# EAGLE design CCM_0022 (EAGLE 9.4.2)

## Sheet 1 of 2: cryocooler
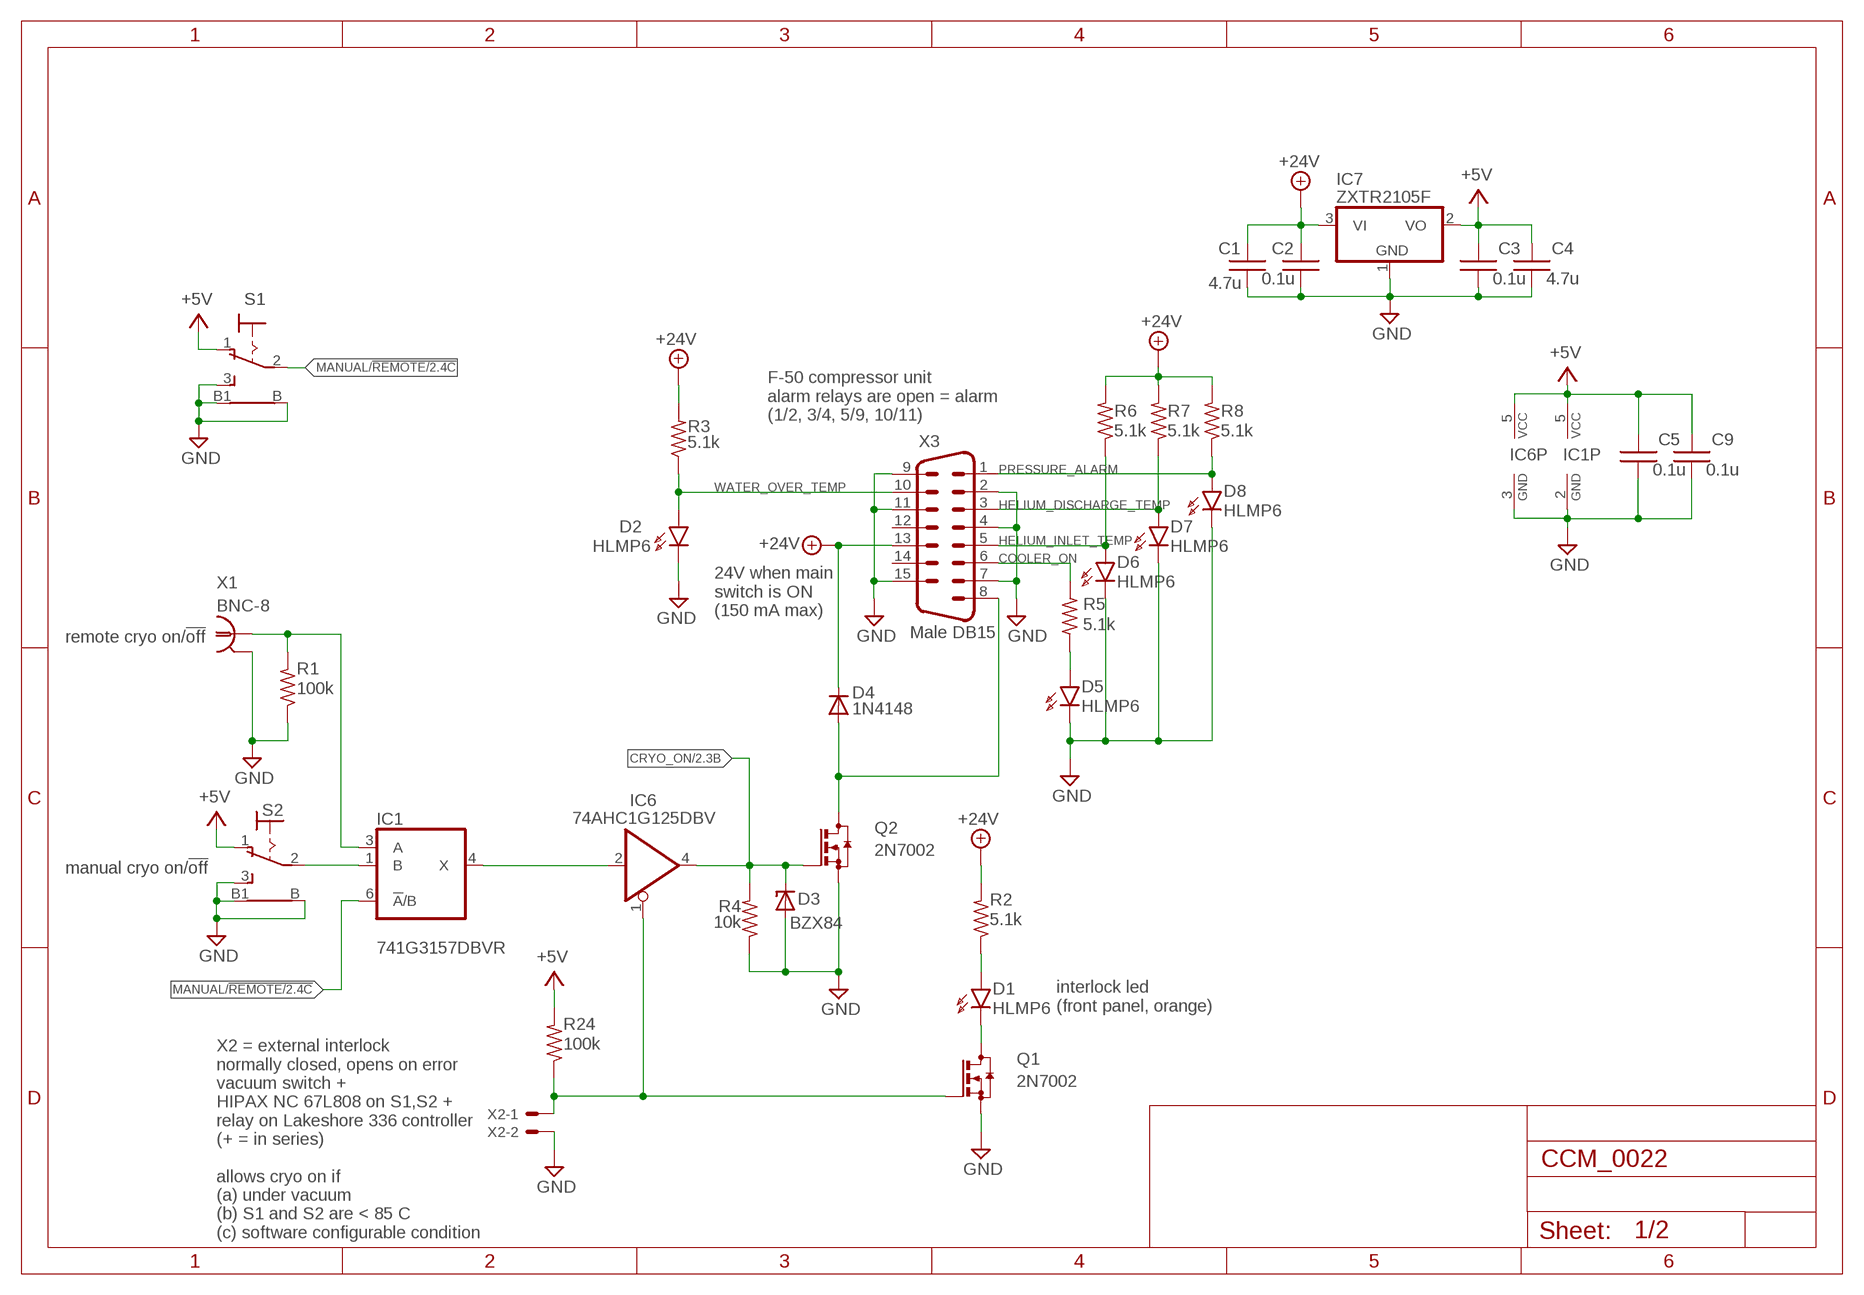
[diagram p0: schematic, sheet 1]

### Parts
C1  4.7u  CAPACITOR0603  [0603]
C2  0.1u  CAPACITOR0603  [0603]
C3  0.1u  CAPACITOR0603  [0603]
C4  4.7u  CAPACITOR0603  [0603]
C5  0.1u  CAPACITOR0603  [0603]
C9  0.1u  CAPACITOR0603  [0603]
D1  HLMP6  [HLMP6]
D2  HLMP6  [HLMP6]
D3  BZX84  BZX84CSMD  [TO236]
D4  1N4148  DIODE-SOD323-W  [SOD323-W]
D5  HLMP6  [HLMP6]
D6  HLMP6  [HLMP6]
D7  HLMP6  [HLMP6]
D8  HLMP6  [HLMP6]
IC1  741G3157DBVR  [DBV_R-PDSO-G6]
IC6  74AHC1G125DBV  [SOT23-5]
IC7  ZXTR2105F  MCP1703CB  [SOT23]
Q1  2N7002  BSS123  [SOT23]
Q2  2N7002  BSS123  [SOT23]
R1  100k  R0603  [0603]
R2  5.1k  R0603  [0603]
R3  5.1k  R0603  [0603]
R4  10k  R0603  [0603]
R5  5.1k  R0603  [0603]
R6  5.1k  R0603  [0603]
R7  5.1k  R0603  [0603]
R8  5.1k  R0603  [0603]
R24  100k  R0603  [0603]
S1  LPV-1  [LPV-1]
S2  LPV-1  [LPV-1]
X1  BNC-8  [BNC_RA]
X2  22-23-2021  [22-23-2021]
X3  Male DB15  M15HP  [M15HP]

### Nets
+5V: C3.1 C4.1 C5.1 C9.1 IC1.5(VCC) IC6.5(VCC) IC7.2(VO) R24.2 S1.1(O) S2.1(O) ; also sheet 2
+24V: C1.1 C2.1 D4.C IC7.3(VI) R2.2 R3.2 R6.2 R7.2 R8.2 X3.13
COOLER_ON: R5.2 X3.6
CRYO_ON: D3.C IC6.4(O) Q2.1(G) R4.2 ; also sheet 2
GND: C1.2 C2.2 C3.2 C4.2 C5.2 C9.2 D2.K D3.A D5.K D6.K D7.K D8.K IC1.2(GND) IC6.3(GND) IC7.1(GND) Q1.2(S) Q2.2(S) R1.1 R4.1 S1.3(S) S1.B S1.B1 S2.3(S) S2.B S2.B1 X1.2 X2.2 X3.2 X3.4 X3.7 X3.9 X3.11 X3.15 ; also sheet 2
HELIUM_DISCHARGE_TEMP: D7.A R7.1 X3.3
HELIUM_INLET_TEMP: D6.A R6.1 X3.5
MANUAL/!REMOTE: IC1.6(!A!/B) S1.2(P) ; also sheet 2
N$1: D1.A R2.1
N$2: IC6.1(OE) Q1.1(G) R24.1 X2.1
N$4: D1.K Q1.3(D)
N$9: IC1.4(X) IC6.2(I)
N$14: D5.A R5.1
N$19: D4.A Q2.3(D) X3.8
N$35: IC1.3(A) R1.2 X1.1
N$40: IC1.1(B) S2.2(P)
PRESSURE_ALARM: D8.A R8.1 X3.1
WATER_OVER_TEMP: D2.A R3.1 X3.10
Unconnected: X3.12 X3.14

### Notes on the sheet
- F-50 compressor unit
  alarm relays are open = alarm
  (1/2, 3/4, 5/9, 10/11)
- 24V when main 
  switch is ON
  (150 mA max)
- remote cryo on/!off
- manual cryo on/!off
- interlock led
  (front panel, orange)
- X2 = external interlock
  normally closed, opens on error
  vacuum switch +
  HIPAX NC 67L808 on S1,S2 +
  relay on Lakeshore 336 controller
  (+ = in series)
  
  allows cryo on if 
  (a) under vacuum
  (b) S1 and S2 are < 85 C
  (c) software configurable condition

## Sheet 2 of 2: heater(s)
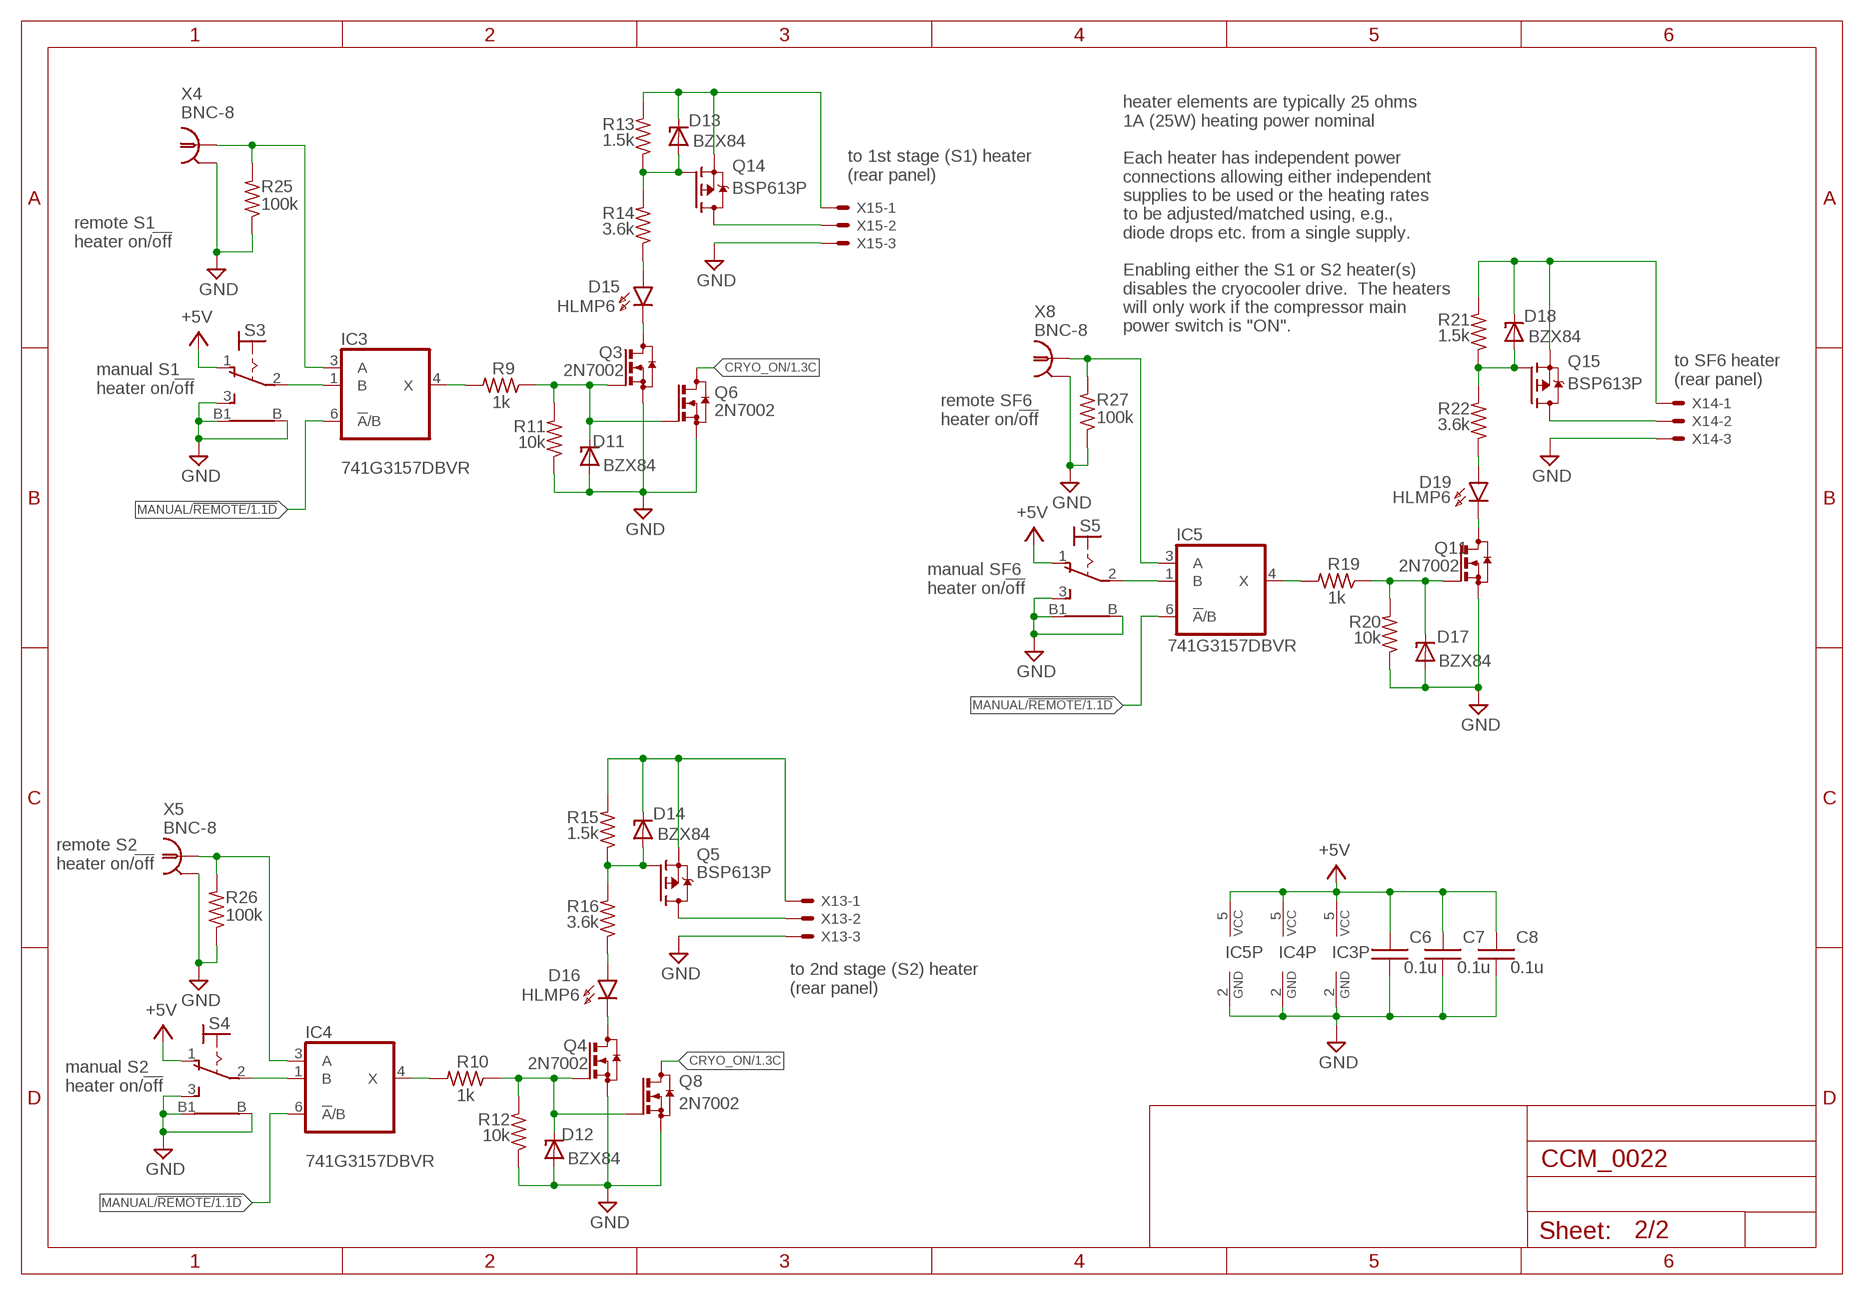
[diagram p1: schematic, sheet 2]

### Parts
C6  0.1u  CAPACITOR0603  [0603]
C7  0.1u  CAPACITOR0603  [0603]
C8  0.1u  CAPACITOR0603  [0603]
D11  BZX84  BZX84CSMD  [TO236]
D12  BZX84  BZX84CSMD  [TO236]
D13  BZX84  BZX84CSMD  [TO236]
D14  BZX84  BZX84CSMD  [TO236]
D15  HLMP6  [HLMP6]
D16  HLMP6  [HLMP6]
D17  BZX84  BZX84CSMD  [TO236]
D18  BZX84  BZX84CSMD  [TO236]
D19  HLMP6  [HLMP6]
IC3  741G3157DBVR  [DBV_R-PDSO-G6]
IC4  741G3157DBVR  [DBV_R-PDSO-G6]
IC5  741G3157DBVR  [DBV_R-PDSO-G6]
Q3  2N7002  BSS123  [SOT23]
Q4  2N7002  BSS123  [SOT23]
Q5  BSP613P  BSP170P  [SOT223]
Q6  2N7002  BSS123  [SOT23]
Q8  2N7002  BSS123  [SOT23]
Q11  2N7002  BSS123  [SOT23]
Q14  BSP613P  BSP170P  [SOT223]
Q15  BSP613P  BSP170P  [SOT223]
R9  1k  R0603  [0603]
R10  1k  R0603  [0603]
R11  10k  R0603  [0603]
R12  10k  R0603  [0603]
R13  1.5k  R0603  [0603]
R14  3.6k  R0603  [0603]
R15  1.5k  R0603  [0603]
R16  3.6k  R0603  [0603]
R19  1k  R0603  [0603]
R20  10k  R0603  [0603]
R21  1.5k  R0603  [0603]
R22  3.6k  R0603  [0603]
R25  100k  R0603  [0603]
R26  100k  R0603  [0603]
R27  100k  R0603  [0603]
S3  LPV-1  [LPV-1]
S4  LPV-1  [LPV-1]
S5  LPV-1  [LPV-1]
X4  BNC-8  [BNC_RA]
X5  BNC-8  [BNC_RA]
X8  BNC-8  [BNC_RA]
X13  22-23-2031  [22-23-2031]
X14  22-23-2031  [22-23-2031]
X15  22-23-2031  [22-23-2031]

### Nets
+5V: C6.1 C7.1 C8.1 IC3.5(VCC) IC4.5(VCC) IC5.5(VCC) S3.1(O) S4.1(O) S5.1(O) ; also sheet 1
CRYO_ON: Q6.3(D) Q8.3(D) ; also sheet 1
GND: C6.2 C7.2 C8.2 D11.A D12.A D17.A IC3.2(GND) IC4.2(GND) IC5.2(GND) Q3.2(S) Q4.2(S) Q6.2(S) Q8.2(S) Q11.2(S) R11.1 R12.1 R20.1 R25.1 R26.1 R27.1 S3.3(S) S3.B S3.B1 S4.3(S) S4.B S4.B1 S5.3(S) S5.B S5.B1 X4.2 X5.2 X8.2 X13.3 X14.3 X15.3 ; also sheet 1
MANUAL/!REMOTE: IC3.6(!A!/B) IC4.6(!A!/B) IC5.6(!A!/B) ; also sheet 1
N$3: D13.C Q14.3(S) R13.2 X15.1
N$5: D14.C Q5.3(S) R15.2 X13.1
N$6: D16.A R16.1
N$7: D16.K Q4.3(D)
N$8: D19.K Q11.3(D)
N$10: D19.A R22.1
N$11: D15.K Q3.3(D)
N$12: D15.A R14.1
N$16: D11.C Q3.1(G) Q6.1(G) R9.1 R11.2
N$17: D13.A Q14.1(G) R13.1 R14.2
N$21: Q14.2(D) Q14.4(D) X15.2
N$23: D12.C Q4.1(G) Q8.1(G) R10.1 R12.2
N$24: D14.A Q5.1(G) R15.1 R16.2
N$26: Q5.2(D) Q5.4(D) X13.2
N$29: IC4.3(A) R26.2 X5.1
N$30: IC4.1(B) S4.2(P)
N$31: D17.C Q11.1(G) R19.1 R20.2
N$32: D18.A Q15.1(G) R21.1 R22.2
N$34: Q15.2(D) Q15.4(D) X14.2
N$39: IC3.3(A) R25.2 X4.1
N$42: IC3.1(B) S3.2(P)
N$45: IC5.3(A) R27.2 X8.1
N$46: IC5.1(B) S5.2(P)
S1_HEATER_ON/!OFF: IC3.4(X) R9.2
S1_HEATER_ON/!OFF1: IC4.4(X) R10.2
S1_HEATER_ON/!OFF2: IC5.4(X) R19.2
SF6_HEATER_VOLTAGE: D18.C Q15.3(S) R21.2 X14.1

### Notes on the sheet
- to 1st stage (S1) heater
  (rear panel)
- remote S1 
  heater on/!off
- heater elements are typically 25 ohms
  1A (25W) heating power nominal
  
  Each heater has independent power 
  connections allowing either independent
  supplies to be used or the heating rates
  to be adjusted/matched using, e.g., 
  diode drops etc. from a single supply.
  
  Enabling either the S1 or S2 heater(s) 
  disables the cryocooler drive.  The heaters
  will only work if the compressor main
  power switch is "ON".
- to SF6 heater
  (rear panel)
- manual S1 
  heater on/!off
- remote SF6 
  heater on/!off
- manual SF6
  heater on/!off
- remote S2 
  heater on/!off
- to 2nd stage (S2) heater
  (rear panel)
- manual S2 
  heater on/!off

## Library data of the parts
C1-C9 = noah:CAPACITOR
D1 D2 D5-D8 D15 D16 D19 = display-hp:HLMP6: LED 2mm horizontal; MF: AGILENT TECHNOLOGIES; MPN: HLMP-6500; OC_FARNELL: 1652490; OC_NEWARK: 40K0088
D3 D11-D14 D17 D18 = diode:BZX84CSMD: Z DIODE
D4 = diode:DIODE-: DIODE
IC1 IC3-IC5 = 74xx-little-de:74*1G3157: Single-Pole, Double-Throw Analog Switch Source: http://focus.ti.com/lit/ds/symlink/sn74lvc1g3157.pdf
IC6 = 74xx-little-de:74*1G125: Single Bus Buffer Gate with 3-State Output
IC7 = linear:MCP1703: 250 mA, 16V, Low Quiescent Current LDO Regulator Source: http://ww1.microchip.com/downloads/en/DeviceDoc/22049b.pdf
Q1-Q4 Q6 Q8 Q11 = transistor-small-signal:BSS123: N-CHANNEL MOS FET
Q5 Q14 Q15 = transistor-fet:BSP170P: SIPMOS(R) Small-Signal-Transistor P-Channel, Enhancement mode Source: http://www.infineon.com/upload/Document/BSP170P_Rev2.4.pdf
R1-R16 R19-R22 R24-R27 = acrooptics:R: 0603 resistor
S1-S5 = switch:LPV-1: TOGGLE SWITCH
X1 X4 X5 X8 = noah:BNC: JACK, RIGHT ANGLE, 50 OHM, PCB, BNC Source: amp_227161.pdf; OC_FARNELL: unknown; OC_NEWARK: unknown
X2 = con-molex:22-23-2021: .100" (2.54mm) Center Header - 2 Pin; MF: MOLEX; MPN: 22-23-2021; OC_FARNELL: 1462926; OC_NEWARK: 25C3832
X3 = con-subd:M15: SUB-D; OC_FARNELL: unknown; OC_NEWARK: unknown
X13-X15 = con-molex:22-23-2031: .100" (2.54mm) Center Header - 3 Pin; MF: MOLEX; MPN: 22-23-2031; OC_FARNELL: 1462950; OC_NEWARK: 30C0862

## Net classes
1 standard: width 0.61 mm, clearance 0.254 mm

## Board
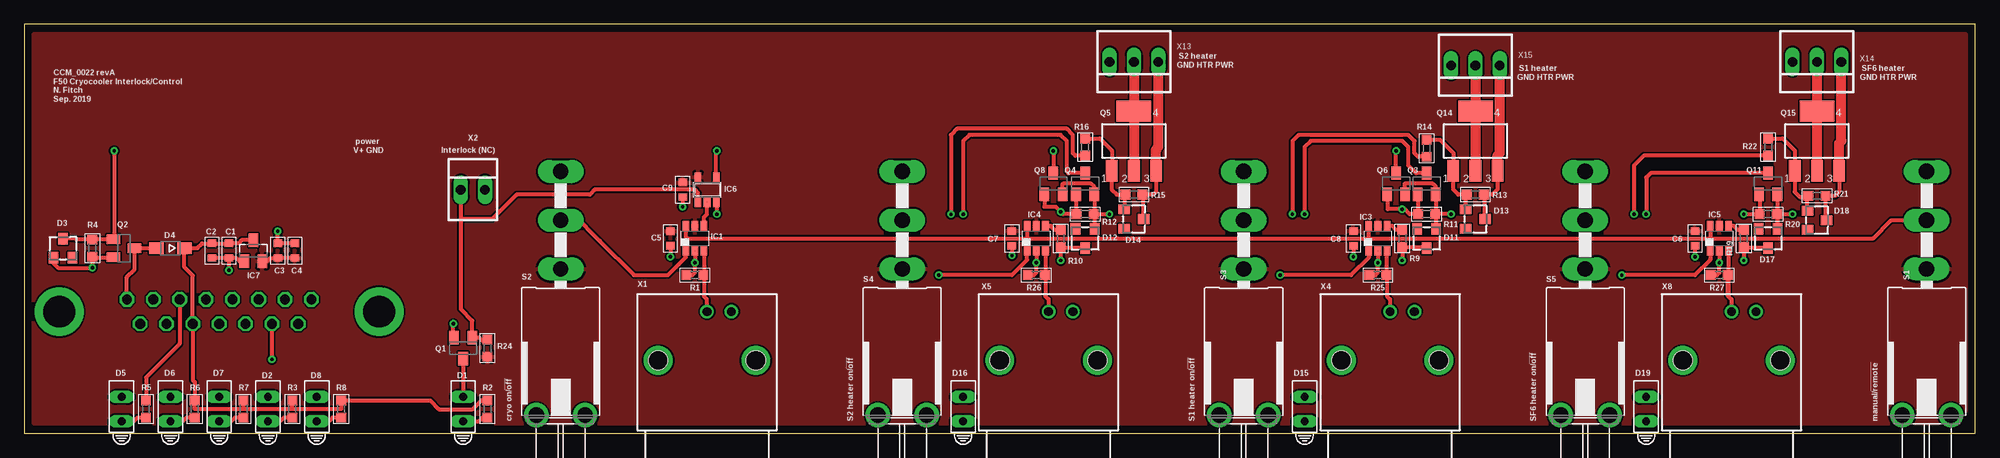
[diagram p2: board, top side]
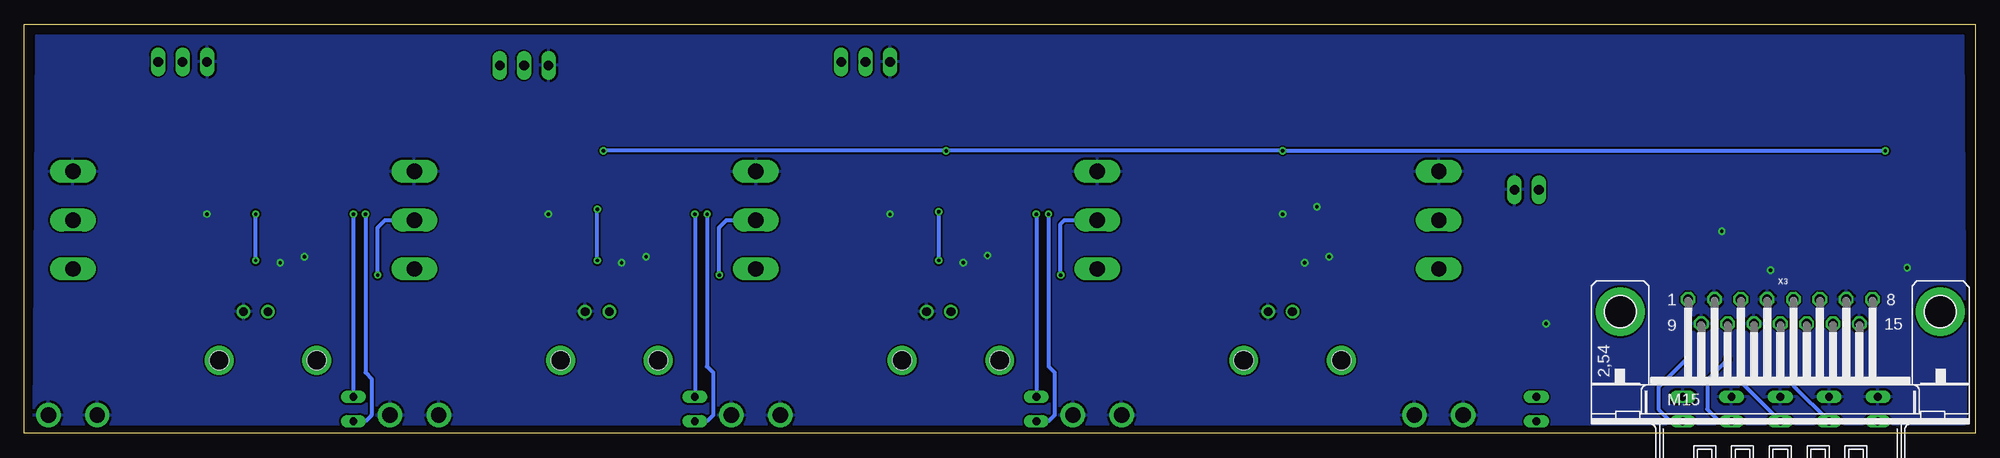
[diagram p3: board, bottom side, seen from below]

Size 203.2 x 42.67 mm. Coordinates in mm from the lower left corner, seen from the top.
Outline: 0,0 203.2,0 203.2,42.67 0,42.67 0,0
Copper layers (1*16): Top 0.035mm / dielectric 1.5mm / Bottom 0.035mm
Design rules "default *": minimum track width 10mil, minimum drill 10mil, track to track 7mil, track to pad 7mil, pad to pad 7mil, via to via 7mil, smd to smd 7mil, copper to edge 10mil, drill to drill 8mil, minimum pad ring 10mil, minimum via ring 8mil, stop-mask expansion 4mil, vias tented up to drill 0mil, thermal gap 10mil

### Footprints (pad centres in the part's own frame; a part is rotated, then mirrored left to right if it is on the bottom)
0603 = smd 0.762 x 0.889: 1 -0.762,0; 2 0.762,0
HLMP6 = drill 0.813 long: A -1.27,0; K 1.27,0
TO236 = smd 1 x 1.2: A -1,-1; C 0,1; NC 1,-1
SOD323-W = smd 1.5 x 1.2: A 1.45,0; C -1.45,0
DBV_R-PDSO-G6 = smd 0.69 x 0.99: 1 -0.95,-1.29; 2 0,-1.29; 3 0.95,-1.29; 4 0.95,1.3; 5 0,1.3; 6 -0.95,1.3
SOT23-5 = smd 0.69 x 0.99: 1 -0.95,-1.29; 2 0,-1.29; 3 0.95,-1.29; 4 0.95,1.3; 5 -0.95,1.3
SOT23 = smd 1 x 1.4: 1 -0.95,-1.1; 2 0.95,-1.1; 3 0,1.1
SOT223 = smd 1.219 x 2.235: 1 -2.311,-3.099; 2 0,-3.099; 3 2.311,-3.099 | smd 3.6 x 2.2: 4 0,3.099
0603' = smd 1.016 x 1.016: 1 -0.889,0; 2 0.889,0
LPV-1 = drill 1.6 long: 1 0,15.24; 2 0,20.32; 3 0,25.4 | drill 1.6 pad 2.54: B -2.54,0; B1 2.54,0
BNC_RA = drill 0.9 pad 1.27: 1 0,-5.08; 2 -2.54,-5.08 | drill 2: P$1 -5.08,0; P$2 5.08,0 | hole 2: -5.08,0; 5.08,0
22-23-2021 = drill 1 long: 1 -1.27,0; 2 1.27,0
M15HP = drill 1.016 octagon: 1 -9.601,1.27; 2 -6.858,1.27; 3 -4.115,1.27; 4 -1.372,1.27; 5 1.372,1.27; 6 4.115,1.27; 7 6.858,1.27; 8 9.601,1.27; 9 -8.23,-1.27; 10 -5.486,-1.27; 11 -2.743,-1.27; 12 0,-1.27; 13 2.743,-1.27; 14 5.486,-1.27; 15 8.23,-1.27 | drill 3.302 pad 5.08: G1 -16.662,0; G2 16.662,0
22-23-2031 = drill 1 long: 1 -2.54,0; 2 0,0; 3 2.54,0

### Placement (x,y rotation side)
C1  21.34,19.05 270 top
C2  19.56,19.05 270 top
C3  26.42,19.05 90 top
C4  28.19,19.05 90 top
C5  67.31,20.32 270 top
C6  173.99,20.32 270 top
C7  102.87,20.32 270 top
C8  138.43,20.32 270 top
C9  68.58,25.4 270 top
D1  45.72,2.54 90 top
D2  25.4,2.54 90 top
D3  4.06,19.3 0 top
D4  15.24,19.3 180 top
D5  10.16,2.54 90 top
D6  15.24,2.54 90 top
D7  20.32,2.54 90 top
D8  30.48,2.54 90 top
D11  146.05,20.32 180 top
D12  110.49,20.32 180 top
D13  151.13,22.35 270 top
D14  115.57,22.35 270 top
D15  133.35,2.54 90 top
D16  97.79,2.54 90 top
D17  181.61,20.32 180 top
D18  186.69,22.23 270 top
D19  168.91,2.54 90 top
IC1  69.85,20.32 0 top
IC3  140.97,20.32 0 top
IC4  105.41,20.32 0 top
IC5  176.53,20.32 0 top
IC6  71.12,25.4 0 top
IC7  23.88,19.05 0 top
Q1  45.72,8.89 180 top
Q2  10.41,19.3 270 top
Q3  146.05,26.04 0 top
Q4  110.49,26.04 0 top
Q5  115.57,30.48 0 top
Q6  142.88,26.04 0 top
Q8  107.19,26.04 0 top
Q11  181.61,26.04 0 top
Q14  151.13,30.48 0 top
Q15  186.69,30.48 0 top
R1  100k  [0603']  69.85,16.51 0 top
R2  5.1k  [0603']  48.26,2.54 90 top
R3  5.1k  [0603']  27.94,2.54 90 top
R4  10k  [0603']  7.11,19.3 90 top
R5  5.1k  [0603']  12.7,2.54 90 top
R6  5.1k  [0603']  17.78,2.54 90 top
R7  5.1k  [0603']  22.86,2.54 90 top
R8  5.1k  [0603']  33.02,2.54 90 top
R9  1k  [0603']  143.51,20.32 90 top
R10  1k  [0603']  107.95,20.32 90 top
R11  10k  [0603']  146.05,22.86 180 top
R12  10k  [0603']  110.49,22.86 180 top
R13  1.5k  [0603']  151.13,24.89 0 top
R14  3.6k  [0603']  146.05,29.72 90 top
R15  1.5k  [0603']  115.57,24.89 0 top
R16  3.6k  [0603']  110.49,29.84 90 top
R19  1k  [0603']  179.07,20.32 90 top
R20  10k  [0603']  181.61,22.86 180 top
R21  1.5k  [0603']  186.69,24.77 0 top
R22  3.6k  [0603']  181.61,29.84 90 top
R24  100k  [0603']  48.26,8.89 270 top
R25  100k  [0603']  140.97,16.51 0 top
R26  100k  [0603']  105.41,16.51 0 top
R27  100k  [0603']  176.53,16.51 0 top
S1  198.12,1.91 0 top
S2  55.88,1.91 0 top
S3  127,1.91 0 top
S4  91.44,1.91 0 top
S5  162.56,1.91 0 top
X1  71.12,7.62 180 top
X2  46.74,25.4 0 top
X3  20.32,12.7 0 bottom
X4  142.24,7.62 180 top
X5  106.68,7.62 180 top
X8  177.8,7.62 180 top
X13  115.57,38.73 180 top
X14  186.69,38.73 180 top
X15  151.13,38.35 180 top

### Tracks (layer width: path | path; a pad name or v marks a point on that pad's centre or on a via)
+5V
  Top 0.406: IC7.2 25.32,17.95 25.65,18.29 C3.1 C4.1
  pour Top: 1.02,1.02 1.02,41.66 202.18,41.66 202.18,1.02
+24V
  Top 0.406: 22.86,2.54 17.78,2.54 R6.2 17.78,5.33 17.58,5.54 X3.13 17.58,16.46 16.69,17.35 D4.C 18.03,19.3 18.54,19.81 C2.1 C1.1 22.35,19.81 22.69,20.15 IC7.3 | 22.86,2.54 R7.2 | 27.94,2.54 33.02,2.54 R8.2 42.29,3.43 43.18,2.54 46.74,2.54 47.65,3.45 48.28,3.45 R2.2 | 27.94,2.54 R3.2 | 27.94,2.54 22.86,2.54
COOLER_ON
  Top 0.406: R5.2 12.7,5.84 16.2,9.35 X3.6
CRYO_ON  (via drill 0.35)
  Top 0.406: D3.C 4.08,20.32 5.33,20.32 5.46,20.19 R4.2 9.25,20.19 Q2.1 9.4,20.34 v9.4,29.46 | IC6.4 72.07,29.4 v72.14,29.46 | v107.19,29.46 Q8.3 | Q6.3 142.88,29.34 v142.88,29.46
  Bottom 0.406: v142.88,29.46 v107.19,29.46 v72.14,29.46 v9.4,29.46
GND  (via drill 0.35)
  Top 0.406: IC1.2 v69.85,17.78 69.85,16.76 69.6,16.51 R1.1 | C5.2 v67.31,18.41 | 111.44,22.92 Q4.2 111.44,25.72 111.12,26.04 108.2,26.04 108.14,25.97 Q8.2 | 111.44,22.92 R12.1 v113.03,22.86 | D12.A 111.49,22.87 111.44,22.92 | IC4.2 v105.41,17.78 105.41,16.76 105.16,16.51 R26.1 | IC3.2 v140.97,17.78 140.97,16.76 140.72,16.51 R25.1 | C7.2 v102.87,18.54 | C8.2 v138.43,18.41 | R11.1 147,22.92 Q3.2 147,25.72 146.69,26.04 143.76,26.04 143.76,25 Q6.2 | v148.59,22.86 R11.1 | D11.A 147.05,22.75 R11.1 | IC5.2 v176.53,17.78 176.53,16.76 176.28,16.51 R27.1 | C6.2 v173.99,18.41 | R20.1 v184.15,22.86 | Q11.2 182.56,22.92 R20.1 | D17.A 182.61,22.75 R20.1 | IC6.3 72.14,24.04 v72.14,22.86 | Q1.2 44.7,10.06 v44.7,11.43 | C9.2 v68.58,23.62 | C1.2 C2.2 | IC7.1 22.44,17.95 22.1,18.29 C1.2 | C1.2 v21.34,17.02 | v26.42,21.08 C3.2 C4.2 | Q2.2 7.17,18.35 R4.1 v7.11,17.27 3.56,17.27 3.06,17.76 D3.A
  pour Bottom: 1.02,1.02 1.27,41.4 201.93,41.4 202.18,1.02
HELIUM_DISCHARGE_TEMP
  Top 0.406: D7.A 21.59,1.27 21.97,1.65 R7.1
  Bottom 0.406: X3.3 24.43,5.38 D7.A
HELIUM_INLET_TEMP
  Top 0.406: R6.1 16.89,1.65 16.51,1.27 D6.A
  Bottom 0.406: X3.5 18.95,4.98 D6.A
MANUAL/!REMOTE
  Top 0.406: IC1.6 68.9,20.51 69.09,20.32 104.39,20.32 | IC4.6 104.46,20.39 104.39,20.32 | 104.39,20.32 113.71,20.32 113.81,20.32 115.33,20.32 115.43,20.32 139.95,20.32 140.02,20.32 | 140.02,20.32 IC3.6 | 140.02,20.32 142.62,20.32 175.58,20.32 | IC5.6 175.58,20.32 | 175.58,20.32 192.53,20.32 194.44,22.23 S1.2
N$1
  Top 0.406: R2.1 47.75,1.65 47.37,1.27 D1.A
N$2
  Top 0.406: R24.1 48.13,9.65 47.75,9.65 47.41,9.99 Q1.1 46.67,11.75 45.47,12.95 45.47,22.35 | IC6.1 70.17,25.08 69.85,25.4 59.44,25.4 58.93,24.89 51.31,24.89 48.77,22.35 45.47,22.35 | X2.1 45.47,22.35
N$3
  Top 0.406: Q14.3 153.44,25.43 152.91,24.89 R13.2 152.13,24.78 D13.C
  Top 1.016: Q14.3 153.44,28.98 153.67,29.21 X15.1
N$4
  Top 0.406: Q1.3 D1.K
N$5
  Top 0.406: Q5.3 117.88,25.17 117.6,24.89 R15.2 116.57,24.78 D14.C
  Top 1.016: Q5.3 117.88,29.62 118.11,29.84 X13.1
N$6  (via drill 0.35)
  Top 0.406: R16.1 109.47,28.96 109.22,29.21 109.22,31.11 108.58,31.75 97.16,31.75 96.52,31.11 v96.52,22.86
  Bottom 0.406: v96.52,22.86 96.52,6.99 95.89,6.35 95.89,1.91 96.52,1.27 D16.A
N$7  (via drill 0.35)
  Top 0.406: Q4.3 108.75,27.14 108.58,27.3 108.58,30.48 107.95,31.11 98.42,31.11 97.79,30.48 v97.79,22.86
  Bottom 0.406: v97.79,22.86 D16.K
N$8  (via drill 0.35)
  Top 0.406: Q11.3 169.38,27.14 168.91,26.67 v168.91,22.86
  Bottom 0.406: v168.91,22.86 D19.K
N$9
  Top 0.406: IC1.4 70.8,22.54 71.12,22.86 IC6.2
N$10  (via drill 0.35)
  Top 0.406: R22.1 168.66,28.96 167.64,27.94 v167.64,22.86
  Bottom 0.406: v167.64,22.86 167.64,6.35 167,5.71 167,1.91 167.64,1.27 D19.A
N$11  (via drill 0.35)
  Top 0.406: Q3.3 144.95,27.14 144.15,27.94 144.15,29.84 143.51,30.48 133.99,30.48 133.35,29.84 v133.35,22.86
  Bottom 0.406: v133.35,22.86 D15.K
N$12  (via drill 0.35)
  Top 0.406: R14.1 145.16,28.83 144.78,29.21 144.78,30.48 144.15,31.11 132.72,31.11 132.08,30.48 v132.08,22.86
  Bottom 0.406: v132.08,22.86 132.08,6.99 131.44,6.35 131.44,1.91 132.08,1.27 D15.A
N$14
  Top 0.406: R5.1 11.81,1.65 11.43,1.27 D5.A
N$16  (via drill 0.35)
  Top 0.406: Q3.1 145.16,24.87 R11.2 144.27,22.86 143.76,23.37 v143.51,23.37 141.99,23.37 141.99,24.87 Q6.1 | v143.51,18.03 R9.1 145.94,19.43 D11.C
  Bottom 0.406: v143.51,18.03 v143.51,23.37
N$17
  Top 0.406: D13.A 150.13,24.78 R13.1 149.35,24.89 148.82,25.43 Q14.1 148.84,27.41 148.84,29.21 147.45,30.61 R14.2
N$19
  Top 0.406: D4.A Q2.3 11.51,17.1 10.72,16.31 X3.8
N$21
  Top 1.016: Q14.2 Q14.4 X15.2
N$23  (via drill 0.35)
  Top 0.406: Q4.1 109.54,22.92 R12.2 108.2,22.86 v107.95,23.11 107.44,23.62 106.24,23.62 Q8.1 | D12.C 108.06,19.32 R10.1 v107.95,18.03
  Bottom 0.406: v107.95,18.03 v107.95,23.11
N$24
  Top 0.406: R16.2 112.01,30.73 113.28,29.46 113.28,27.41 Q5.1 113.26,25.43 113.79,24.89 R15.1 114.57,24.78 D14.A
N$26
  Top 1.016: Q5.2 Q5.4 X13.2
N$29
  Top 0.406: IC4.3 106.36,16.51 | 106.36,16.51 106.36,14.29 106.68,13.97 X5.1 | R26.2 106.36,16.51
N$30  (via drill 0.35)
  Top 0.406: IC4.1 104.46,18.1 102.87,16.51 v95.25,16.51
  Bottom 0.406: v95.25,16.51 95.25,21.84 94.87,22.23 S4.2
N$31  (via drill 0.35)
  Top 0.406: Q11.1 180.72,24.87 R20.2 v179.07,22.86 | D17.C 179.18,19.32 R19.1 v179.07,18.03
  Bottom 0.406: v179.07,18.03 v179.07,22.86
N$32
  Top 0.406: D18.A 185.69,24.65 | 185.69,24.65 R21.1 | 185.69,24.65 184.9,24.65 184.38,25.17 Q15.1 184.4,27.41 184.4,29.46 183.13,30.73 R22.2
N$34
  Top 1.016: Q15.2 Q15.4 X14.2
N$35
  Top 0.406: IC1.3 70.8,16.45 | X1.1 71.12,13.97 70.8,14.29 70.8,16.26 70.8,16.45 | R1.2 70.8,16.45
N$39
  Top 0.406: X4.1 142.24,13.97 141.92,14.29 141.92,16.45 R25.2 141.92,16.57 IC3.3
N$40
  Top 0.406: S2.2 57.78,22.23 59.31,20.7 59.94,20.07 63.5,16.51 67.06,16.51 68.9,18.35 IC1.1
N$42  (via drill 0.35)
  Top 0.406: IC3.1 140.02,18.35 138.18,16.51 v130.81,16.51
  Bottom 0.406: v130.81,16.51 130.81,21.46 130.05,22.23 S3.2
N$45
  Top 0.406: IC5.3 177.48,14.29 | 177.48,14.29 177.8,13.97 X8.1 | 177.48,14.29 177.42,14.35 R27.2
N$46  (via drill 0.35)
  Top 0.406: IC5.1 175.58,18.1 173.99,16.51 v166.37,16.51
  Bottom 0.406: v166.37,16.51 166.37,21.46 165.61,22.23 S5.2
PRESSURE_ALARM
  Top 0.406: R8.1 32.13,1.65 31.75,1.27 D8.A
  Bottom 0.406: D8.A 31.75,1.27 33.02,2.54 33.02,4.83 29.92,7.92 X3.1
S1_HEATER_ON/!OFF
  Top 0.406: R9.2 142.88,21.21 142.46,21.62 IC3.4
S1_HEATER_ON/!OFF1
  Top 0.406: R10.2 107.31,21.21 106.9,21.62 IC4.4
S1_HEATER_ON/!OFF2
  Top 0.406: R19.2 178.44,21.21 178.02,21.62 IC5.4
SF6_HEATER_VOLTAGE
  Top 0.406: D18.C 187.58,22.34 R21.2 188.59,24.77 189,25.17 Q15.3
  Top 1.016: Q15.3 189,30.25 189.23,30.48 X14.1
WATER_OVER_TEMP  (via drill 0.35)
  Top 0.406: R3.1 27.05,1.65 26.67,1.27 D2.A | X3.10 v25.81,7.72
  Bottom 0.406: D2.A 26.67,1.27 27.94,2.54 27.94,5.59 v25.81,7.72

### Text on the board
tPlace: S2 heater / GND HTR PWR | S1 heater / GND HTR PWR | SF6 heater / GND HTR PWR | CCM_0022 revA / F50 Cryocooler Interlock/Control / N. Fitch / Sep. 2019 | power / V+ GND | Interlock (NC) | cryo on/!off | S2 heater on/!off | S1 heater on/!off | SF6 heater on/!off | manual/!remote